# Altium schematic sheet SheetTemplate.SchDoc
size C